# Altium schematic sheet MCU.SchDoc
size A2
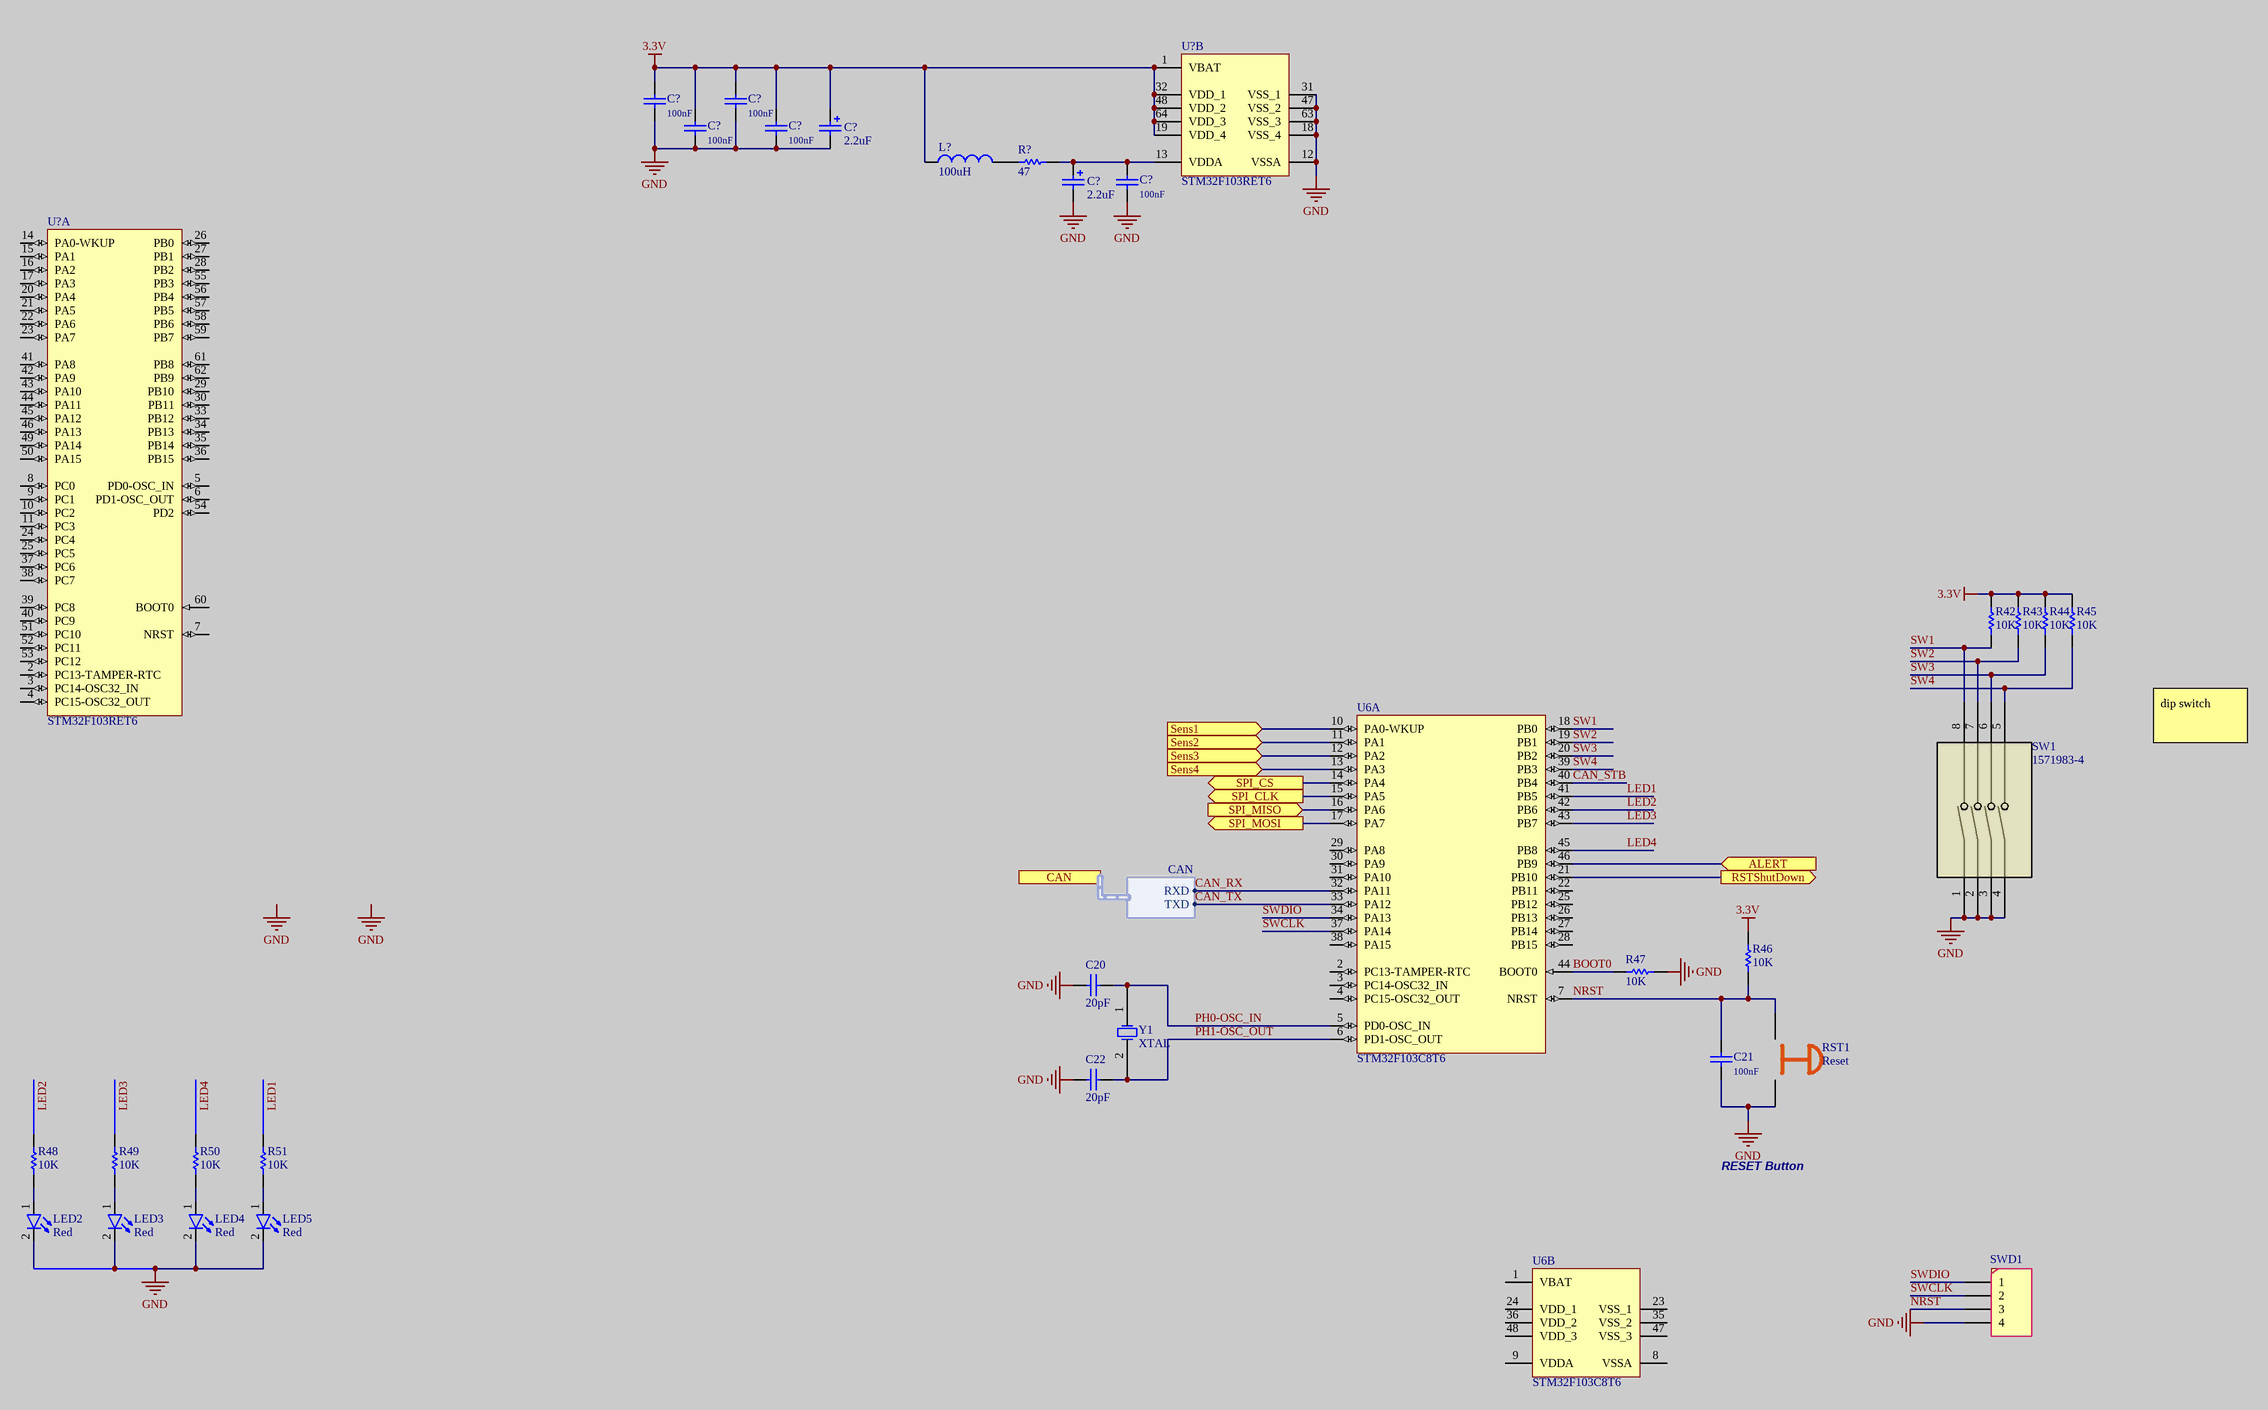
[diagram p0: MCU.SchDoc]

## Parts
(Parts that share a designator on the sheet are numbered #1, #2 ... from top to bottom, then left to right.)
C20  20pF  [CAPC0603]
C21  100nF  [CAPC0603]
C22  20pF  [CAPC0603]
C?#1  100nF  [CAPC0603]
C?#2  100nF  [CAPC0603]
C?#3  100nF  [CAPC0603]
C?#4  100nF  [CAPC0603]
C?#5  2.2uF  [C1206]
C?#6  100nF  [CAPC0603]
C?#7  2.2uF  [C1206]
L?  100uH  [RES1206]
LED2  Red  [LED]
LED3  Red  [LED]
LED4  Red  [LED]
LED5  Red  [LED]
R42  10K  [RESC0603]
R43  10K  [RESC0603]
R44  10K  [RESC0603]
R45  10K  [RESC0603]
R46  10K  [RESC0603]
R47  10K  [RESC0603]
R48  10K  [RESC0603]
R49  10K  [RESC0603]
R50  10K  [RESC0603]
R51  10K  [RESC0603]
R?  47  [RESC0603]
RST1  Reset  [SWITCH-PB4]
SW1  1571983-4  [SW4_1571983_4P_TEC]
SWD1  (no value)  [HEADER1*4]
U6  STM32F103C8T6  [STM32F103C8T6]  (parts A,B of 2)
U?#1  STM32F103RET6  [LQFP, 64]  (part B of 2)
U?#2  STM32F103RET6  [LQFP, 64]  (part A of 2)
Y1  XTAL  [XTAL]

## Ports
ALERT (in), CAN (harness CAN), RSTShutDown (out), Sens1 (in), Sens2 (in), Sens3 (in), Sens4 (in), SPI_CLK (out), SPI_CS (out), SPI_MISO (in), SPI_MOSI (out)

## Harnesses
CAN: RXD, TXD

## Nets
3.3V: C?#1.1 C?#2.1 C?#3.1 C?#4.1 C?#5.1 L?.1 R42.2 R43.2 R44.2 R45.2 R46.2 U?#1.1(VBAT) U?#1.19(VDD_4) U?#1.32(VDD_1) U?#1.48(VDD_2) U?#1.64(VDD_3)
GND: C20.1 C21.2 C22.1 C?#1.2 C?#2.2 C?#3.2 C?#4.2 C?#5.2 C?#6.2 C?#7.2 LED2.2(K) LED3.2(K) LED4.2(K) LED5.2(K) R47.1 RST1.2 SW1.1 SW1.2 SW1.3 SW1.4 SWD1.4 U?#1.12(VSSA) U?#1.18(VSS_4) U?#1.31(VSS_1) U?#1.47(VSS_2) U?#1.63(VSS_3)
ALERT: U6.46(PB9) ; port ALERT
BOOT0: R47.2 U6.44(BOOT0)
CAN_RX: U6.32(PA11) ; port CAN.RXD
CAN_STB: U6.40(PB4)
CAN_TX: U6.33(PA12) ; port CAN.TXD
LED1: R51.2 U6.41(PB5)
LED2: R48.2 U6.42(PB6)
LED3: R49.2 U6.43(PB7)
LED4: R50.2 U6.45(PB8)
NRST: C21.1 R46.1 RST1.1 SWD1.3 U6.7(NRST)
PH0-OSC_IN: C20.2 U6.5(PD0-OSC_IN) Y1.1
PH1-OSC_OUT: C22.2 U6.6(PD1-OSC_OUT) Y1.2
RSTShutDown: U6.21(PB10) ; port RSTShutDown
Sens1: U6.10(PA0-WKUP) ; port Sens1
Sens2: U6.11(PA1) ; port Sens2
Sens3: U6.12(PA2) ; port Sens3
Sens4: U6.13(PA3) ; port Sens4
SPI_CLK: U6.15(PA5) ; port SPI_CLK
SPI_CS: U6.14(PA4) ; port SPI_CS
SPI_MISO: U6.16(PA6) ; port SPI_MISO
SPI_MOSI: U6.17(PA7) ; port SPI_MOSI
SW1: R42.1 SW1.8 U6.18(PB0)
SW2: R43.1 SW1.7 U6.19(PB1)
SW3: R44.1 SW1.6 U6.20(PB2)
SW4: R45.1 SW1.5 U6.39(PB3)
SWCLK: SWD1.2 U6.37(PA14)
SWDIO: SWD1.1 U6.34(PA13)
NetC?#6_1: C?#6.1 C?#7.1 R?.1 U?#1.13(VDDA)
NetL?_2: L?.2 R?.2
NetLED2_1: LED2.1(A) R48.1
NetLED3_1: LED3.1(A) R49.1
NetLED4_1: LED4.1(A) R50.1
NetLED5_1: LED5.1(A) R51.1

Not connected (* = marked no-connect by the designer): U6 1(VBAT) 2(PC13-TAMPER-RTC) 3(PC14-OSC32_IN) 4(PC15-OSC32_OUT) 8(VSSA) 9(VDDA) 22(PB11) 23(VSS_1) 24(VDD_1) 25(PB12) 26(PB13) 27(PB14) 28(PB15) 29(PA8) 30(PA9) 31(PA10) 35(VSS_2) 36(VDD_2) 38(PA15) 47(VSS_3) 48(VDD_3); U?#2 2(PC13-TAMPER-RTC) 3(PC14-OSC32_IN) 4(PC15-OSC32_OUT) 5(PD0-OSC_IN) 6(PD1-OSC_OUT) 7(NRST) 8(PC0) 9(PC1) 10(PC2) 11(PC3) 14(PA0-WKUP) 15(PA1) 16(PA2) 17(PA3) 20(PA4) 21(PA5) 22(PA6) 23(PA7) 24(PC4) 25(PC5) 26(PB0) 27(PB1) 28(PB2) 29(PB10) 30(PB11) 33(PB12) 34(PB13) 35(PB14) 36(PB15) 37(PC6) 38(PC7) 39(PC8) 40(PC9) 41(PA8) 42(PA9) 43(PA10) 44(PA11) 45(PA12) 46(PA13) 49(PA14) 50(PA15) 51(PC10) 52(PC11) 53(PC12) 54(PD2) 55(PB3) 56(PB4) 57(PB5) 58(PB6) 59(PB7) 60(BOOT0) 61(PB8) 62(PB9)

## Notes on the sheet
- dip switch
- RESET Button
- Labels drawn without touching a wire or pin: GND

## Library data of the parts
C20-C22 C?#1-C?#4 C?#6 = Capacitor: Published: 8-Jun-2000; LatestRevisionDate: 17-Jul-2002; LatestRevisionNote: Re-released for DXP Platform.; PackageReference: C0805; Publisher: Altium Limited
  C20 C22: Value: 20pF
  C21 C?#1-C?#4 C?#6: Value: 100nF
C?#5 C?#7 = Cap_Tan: Tantalium Capacitor Size C; Published: 8-Jun-2000; LatestRevisionDate: 17-Jul-2002; LatestRevisionNote: Re-released for DXP Platform.; PackageReference: C0805; Publisher: Altium Limited
L? = INDUCTOR: Value: 68uH; Code_IEC: 1005; Published: 8-Jun-2000; Publisher: Altium Limited; LatestRevisionDate: 17-Jul-2002; LatestRevisionNote: Re-released for DXP Platform.; PackageReference: 0402-A; Code_JEITA: 0402
LED2-LED5 = LED: Designer: Saeid Jorablo; Organazation: ControTec; Adding Date: 1387/12/22; Color: Red; Size: SMD 0603
R42-R51 R? = Resistor: 0603,0.1W; Published: 8-Jun-2000; LatestRevisionDate: 17-Jul-2002; LatestRevisionNote: Re-released for DXP Platform.; PackageReference: AXIAL-0.5; Publisher: Altium Limited
  R42-R51: Value: 10K
  R?: Value: 47
RST1 = Swtich-PB4: 4-Pin Push Button
SW1 = 1571983-4: GDH04S04=DIP SWITCH; Manufacturer_Name: TE Connectivity; Copyright: Copyright (C) 2025 Ultra Librarian. All rights reserved.; Manufacturer_Part_Number: 1571983-4; RefDes: RefDes; Type: Type
SWD1 = Header1*4: Header, 4-Pin
U6 = STM32F103C8T6: ARM Cortex-M3 32-bit MCU, 64 KB Flash, 20 KB Internal RAM, 37 I/Os, 48-pin LQFP, -40 to 85 degC, Tray; A/D Converter: 2x12-bit (10 Channel); FLASH Size (Prog) (kB): 64; I/Os (High Current): 37; Internal RAM Size (kB): 20; Operating Frequency(F) (Processor speed) (MHz): 72; Supply Voltage(Vcc) min (V): 2; DatasheetVersion: Rev. 16; PackageVersion: Rev. 6, 06/2013; PackageReference: LQFP48; PackageDescription: 48-Pin Low Profile Quad Flat Package, 7 x 7 mm Body, 0.5 mm Pitch; Supplier 1: Digi-Key; Supplier Part Number 1: 497-6063-ND; Supplier 2: Farnell; Supplier Part Number 2: 1447637; Supplier 3: Newark; Supplier Part Number 3: 59M2182; Supplier 4: Newark; Supplier Part Number 4: 57P1222; Supplier 5: Mouser; Supplier Part Number 5: 511-STM32F103C8T6; Core: ARM Cortex-M3; Packing: Tray; Mounting Technology: Surface Mount; PartNumber: STM32F103C8T6; ComponentLink1Description: Manufacturer URL; ComponentLink1URL: http://www.st.com/web/en/home.html; ComponentLink2Description: Datasheet; ComponentLink2URL: http://www.st.com/st-web-ui/static/active/en/resource/technical/document/datasheet/CD00161566.pdf; ComponentLink3Description: Package Specification; ComponentLink3URL: http://www.st.com/st-web-ui/static/active/en/resource/technical/document/datasheet/DM00058181.pdf
U?#1 U?#2 = STM32F103RET6: ARM Cortex-M3 32-bit MCU, 512 KB Flash, 64 KB Internal RAM, 51 I/Os, 64-pin LQFP, -40 to 85 degC, Tray; A/D Converter: 3x12-bit (16 Channel); D/A Converter: 2x12-bit (2 Channel); FLASH Size (Prog) (kB): 512; I/Os (High Current): 51; Internal RAM Size (kB): 64; Operating Frequency(F) (Processor speed) (MHz): 72; Supply Voltage(Vcc) min (V): 2; DatasheetVersion: Rev. 8; PackageVersion: Rev. 4, 06/2013; PackageReference: LQFP64; PackageDescription: 64-Pin Low Profile Quad Flat Package, 10 x 10 mm Body, 0.5 mm Pitch; Supplier 1: Digi-Key; Supplier Part Number 1: 497-6444-ND; Supplier 2: Farnell; Supplier Part Number 2: 1624138; Supplier 3: Newark; Supplier Part Number 3: 01P4101; Supplier 4: Newark; Supplier Part Number 4: 57P1231; Supplier 5: Mouser; Supplier Part Number 5: 511-STM32F103RET6; Core: ARM Cortex-M3; Packing: Tray; Mounting Technology: Surface Mount; PartNumber: STM32F103RET6; ComponentLink1Description: Manufacturer URL; ComponentLink1URL: http://www.st.com/web/en/home.html; ComponentLink2Description: Datasheet; ComponentLink2URL: http://www.st.com/st-web-ui/static/active/en/resource/technical/document/datasheet/CD00191185.pdf; ComponentLink3Description: Package Specification; ComponentLink3URL: http://www.st.com/st-web-ui/static/active/en/resource/technical/document/datasheet/DM00037051.pdf